# Altium project Framework 2 USB-C Expansion Card.PrjPcb
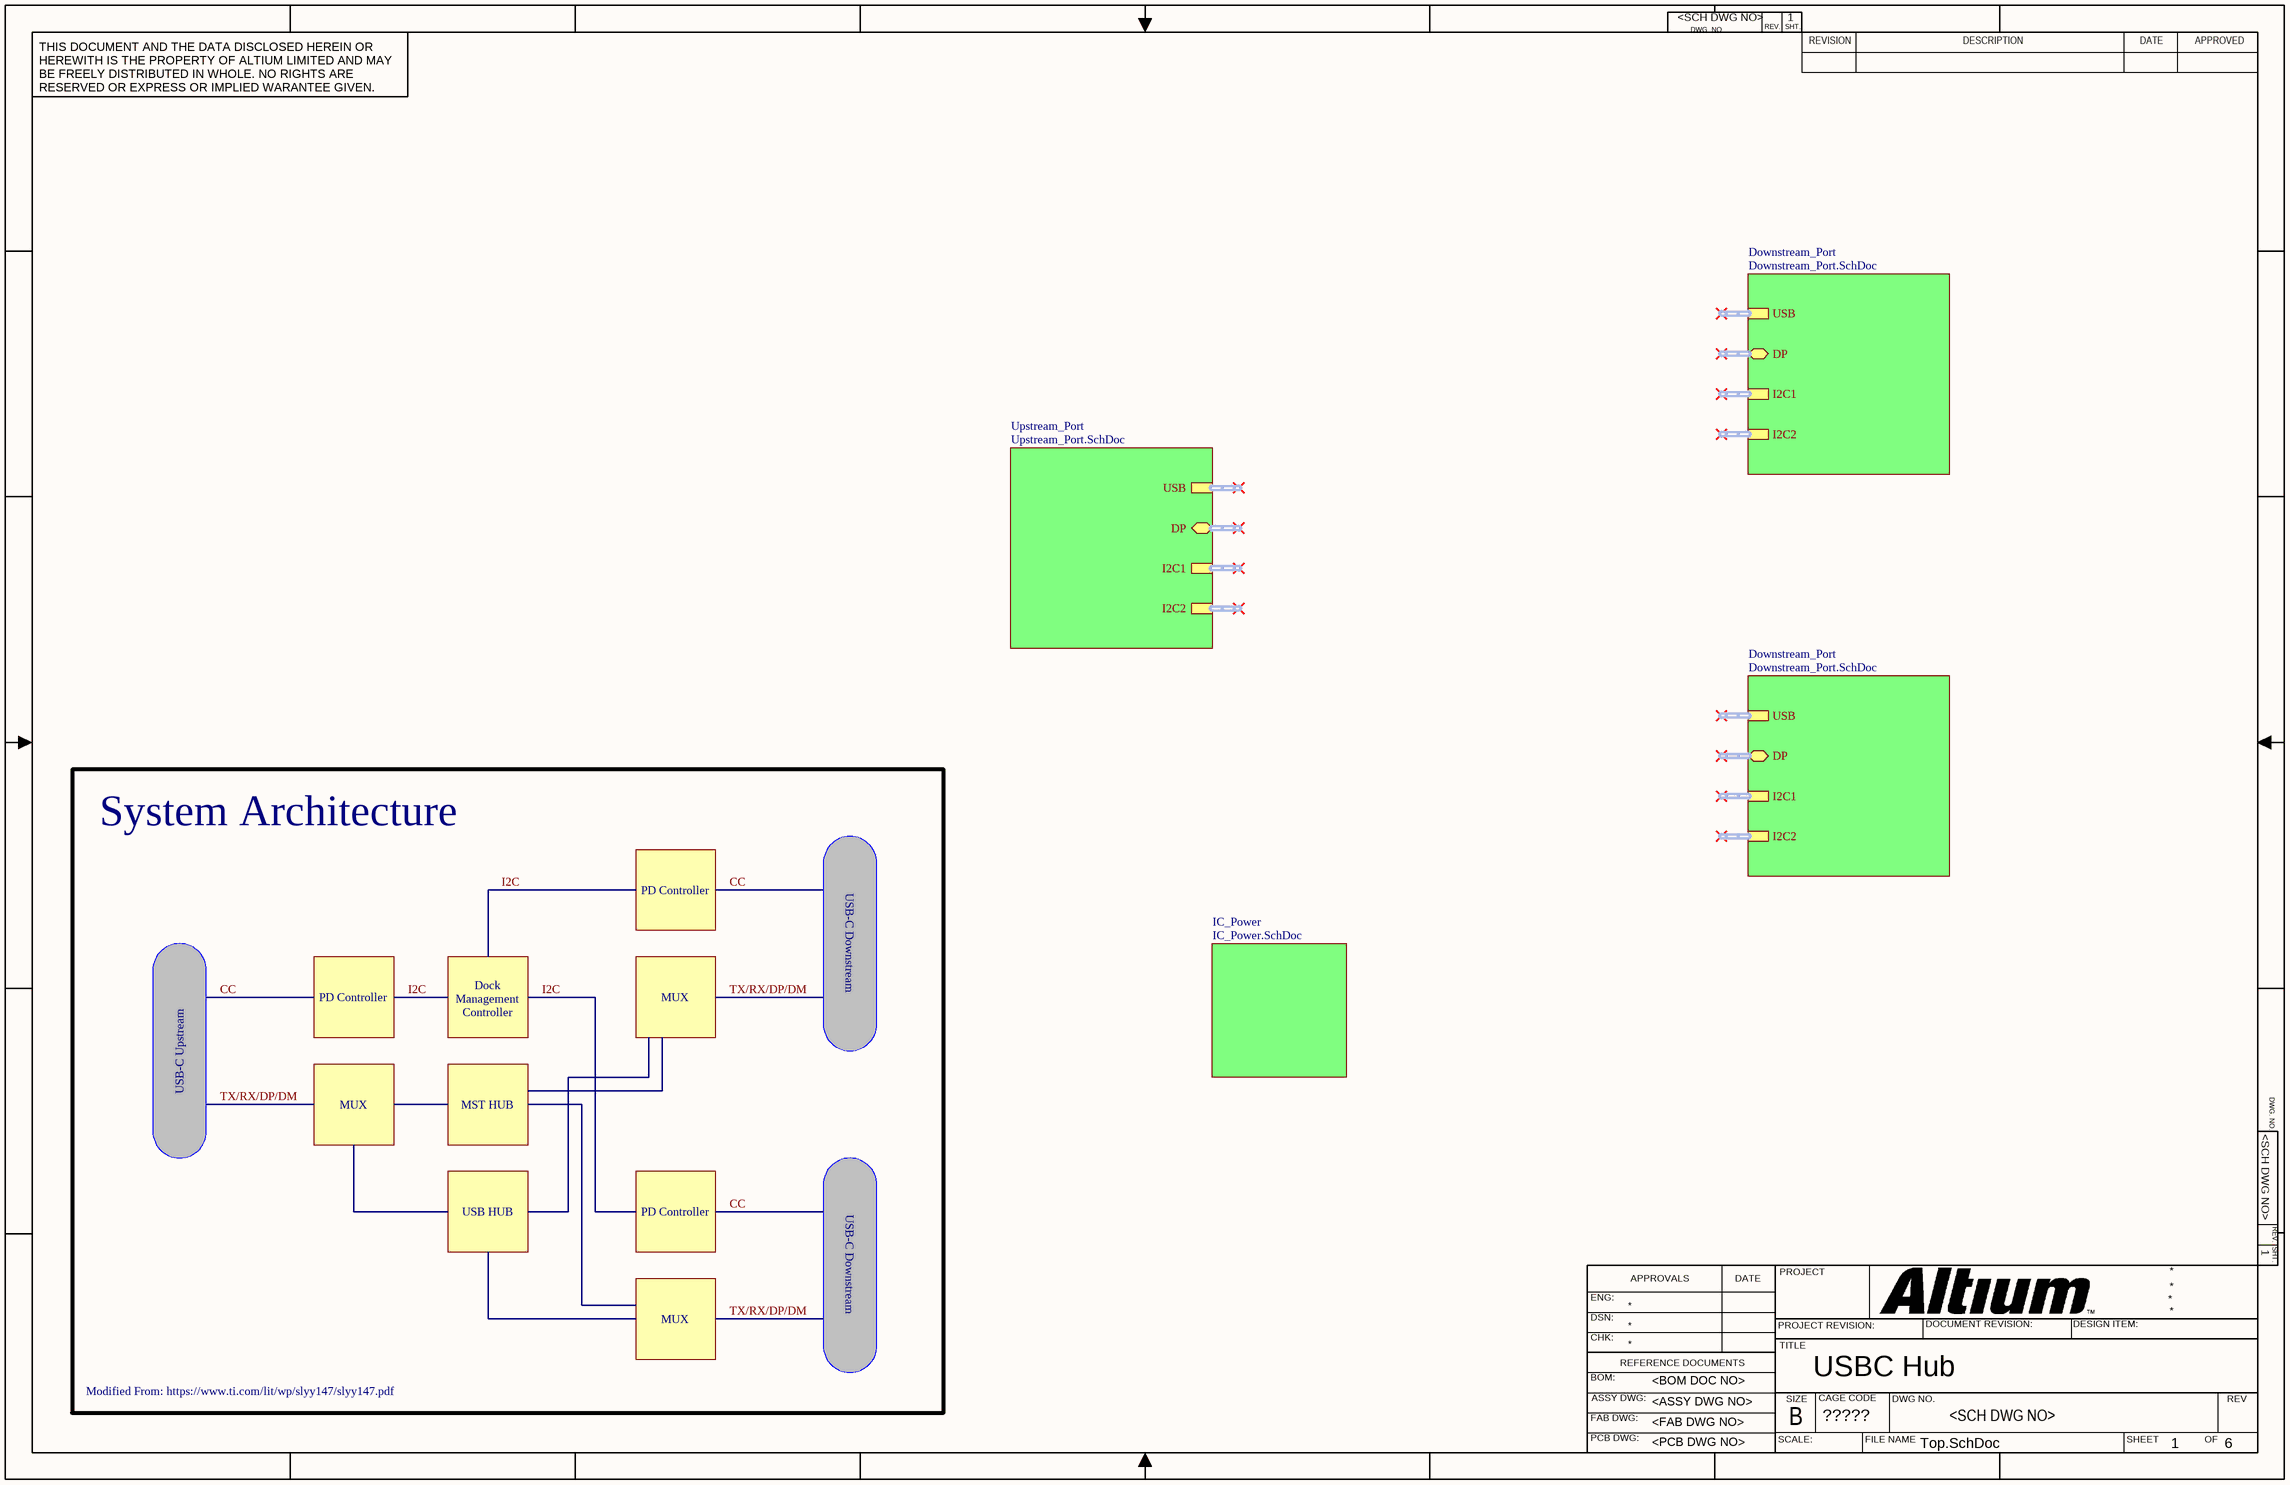
[diagram p0: Top.SchDoc]
CAGE_CODE: ?????; CONTRACT_NUMBER: <CONTRACT NO>; DOC_NO_ASSY_DWG: <ASSY DWG NO>; DOC_NO_BOM: <BOM DOC NO>; DOC_NO_FAB_DWG: <FAB DWG NO>; DOC_NO_SCH_DWG: <SCH DWG NO>; PCB_2_DEC_TOL: +/-.01; PCB_3_DEC_TOL: +/-.010; PCB_ANG_TOL: +/-1/2; PCB_ASSEMBLY_NO: <PCB ASSY NO>; PCB_CHECKER: - -----; PCB_CHECKER_APP_DATE: --/--/----; PCB_DESIGNER: - -----; PCB_DESIGNER_APP_DATE: --/--/----; PCB_DWG_NO: <PCB DWG NO>; PCB_ENGINEER: - -----; PCB_ENGINEER_APP_DATE: --/--/----; PCB_PART_NUMBER: <PCB PN>; PCB_REV: A; SCH_REV: A
6 sheets, 168 parts. Net scope: hierarchical (ports join the sheet entries above them; power ports are global).
Board file: PCB1.PcbDoc
Sheets:
  Top.SchDoc
    Downstream_Port = Downstream_Port.SchDoc
      Port_Controller = Port_Controller.SchDoc
      Port_Power = Port_Power.SchDoc
    Upstream_Port = Upstream_Port.SchDoc
      Port_Controller = Port_Controller.SchDoc
      Port_Power = Port_Power.SchDoc
    IC_Power = IC_Power.SchDoc
    Downstream_Port = Downstream_Port.SchDoc
      Port_Controller = Port_Controller.SchDoc
      Port_Power = Port_Power.SchDoc

## Sheet Top.SchDoc: USBC Hub
size 431 x 279 mm; Author: Eric Liu; SheetNumber: 1; SheetTotal: 6

### Sub-sheets
Downstream_Port = Downstream_Port.SchDoc: USB (harness USB), I2C1 (harness USB), DP (bidir, harness DP), I2C2 (harness USB)
Downstream_Port = Downstream_Port.SchDoc: USB (harness USB), I2C1 (harness USB), DP (bidir, harness DP), I2C2 (harness USB)
IC_Power = IC_Power.SchDoc: no entries
Upstream_Port = Upstream_Port.SchDoc: USB (harness USB), I2C1 (harness USB), DP (bidir, harness DP), I2C2 (harness USB)

### Notes on the sheet
- System Architecture
- PD Controller
- USB-C Downstream
- Dock
  Management
  Controller
- MUX
- USB-C Upstream
- MST HUB
- USB HUB
- Modified From: https://www.ti.com/lit/wp/slyy147/slyy147.pdf
- DWG. NO.
- REV.
- SHT.
- THIS DOCUMENT AND THE DATA DISCLOSED HEREIN OR HEREWITH IS THE PROPERTY OF ALTIUM LIMITED AND MAY BE FREELY DISTRIBUTED IN WHOLE. NO RIGHTS ARE RESERVED OR EXPRESS OR IMPLIED WARANTEE GIVEN.
- REVISION
- DESCRIPTION
- DATE
- APPROVED
- ENG:
- APPROVALS
- PROJECT
- DSN:
- CHK:
- REFERENCE DOCUMENTS
- PROJECT REVISION:
- TITLE
- DOCUMENT REVISION:
- DESIGN ITEM:
- BOM:
- FAB DWG:
- PCB DWG:
- ASSY DWG:
- SCALE:
- SIZE
- B
- CAGE CODE
- FILE NAME
- DWG NO.
- SHEET
- OF
- REV

## Sheet Downstream_Port.SchDoc: Downstream Port
size 431 x 279 mm; Author: Eric Liu; SheetNumber: 2; SheetTotal: 6
Used 2 times, as channels Downstream_Port, Downstream_Port. Parts and nets are listed once, with the designators drawn on the sheet.
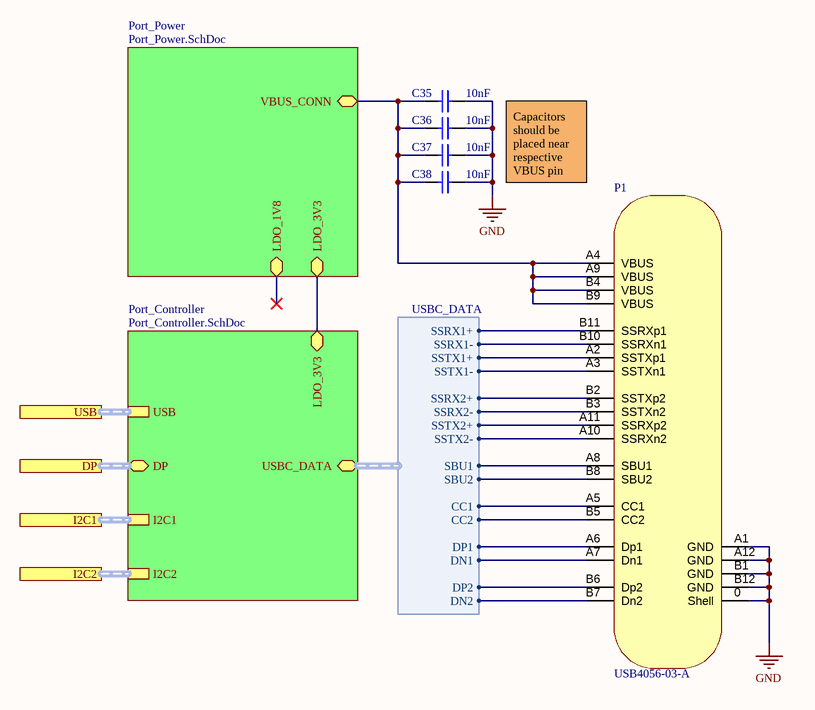
[diagram p1: Downstream_Port.SchDoc]

### Parts
C35  value 10nF  [CAP0402]  (hidden comment: CC0402KRX7R9BB103)
C36  value 10nF  [CAP0402]  (hidden comment: CC0402KRX7R9BB103)
C37  value 10nF  [CAP0402]  (hidden comment: CC0402KRX7R9BB103)
C38  value 10nF  [CAP0402]  (hidden comment: CC0402KRX7R9BB103)
P1  USB4056-03-A  [USB4056-03-A]

### Sub-sheets
Port_Controller = Port_Controller.SchDoc: USB (harness USB), I2C1 (harness USB), DP (bidir, harness DP), USBC_DATA (bidir, harness USBC_DATA), LDO_3V3 (bidir), I2C2 (harness USB)
Port_Power = Port_Power.SchDoc: LDO_3V3 (bidir), LDO_1V8 (bidir), VBUS_CONN (bidir)

### Ports
DP, I2C1, I2C2, USB

### Harnesses
USBC_DATA: SSRX1+, SSRX1-, SSTX1+, SSTX1-, SSRX2+, SSRX2-, SSTX2+, SSTX2-, CC1, CC2, SBU1, SBU2, DP1, DN1, DP2, DN2

### Nets
GND: C35.1 C36.1 C37.1 C38.1 P1.0(Shell) P1.A1(GND) P1.A12(GND) P1.B1(GND) P1.B12(GND)
NetC35_2: C35.2 C36.2 C37.2 C38.2 P1.A4(VBUS) P1.A9(VBUS) P1.B4(VBUS) P1.B9(VBUS) ; sheet Port_Power/VBUS_CONN
NetP1_A2: P1.A2(SSTXp1) ; sheet Port_Controller/USBC_DATA.SSTX1+
NetP1_A3: P1.A3(SSTXn1) ; sheet Port_Controller/USBC_DATA.SSTX1-
NetP1_A5: P1.A5(CC1) ; sheet Port_Controller/USBC_DATA.CC1
NetP1_A6: P1.A6(Dp1) ; sheet Port_Controller/USBC_DATA.DP1
NetP1_A7: P1.A7(Dn1) ; sheet Port_Controller/USBC_DATA.DN1
NetP1_A8: P1.A8(SBU1) ; sheet Port_Controller/USBC_DATA.SBU1
NetP1_A10: P1.A10(SSRXn2) ; sheet Port_Controller/USBC_DATA.SSTX2-
NetP1_A11: P1.A11(SSRXp2) ; sheet Port_Controller/USBC_DATA.SSTX2+
NetP1_B2: P1.B2(SSTXp2) ; sheet Port_Controller/USBC_DATA.SSRX2+
NetP1_B3: P1.B3(SSTXn2) ; sheet Port_Controller/USBC_DATA.SSRX2-
NetP1_B5: P1.B5(CC2) ; sheet Port_Controller/USBC_DATA.CC2
NetP1_B6: P1.B6(Dp2) ; sheet Port_Controller/USBC_DATA.DP2
NetP1_B7: P1.B7(Dn2) ; sheet Port_Controller/USBC_DATA.DN2
NetP1_B8: P1.B8(SBU2) ; sheet Port_Controller/USBC_DATA.SBU2
NetP1_B10: P1.B10(SSRXn1) ; sheet Port_Controller/USBC_DATA.SSRX1-
NetP1_B11: P1.B11(SSRXp1) ; sheet Port_Controller/USBC_DATA.SSRX1+
(unnamed): sheet Port_Controller/LDO_3V3, sheet Port_Power/LDO_3V3

### Channels
Downstream_Port: designators end in _1
Downstream_Port: designators end in _2

### Buses and harness runs
harness port DP = sheet Port_Controller/DP
harness port I2C1 = sheet Port_Controller/I2C1
harness port I2C2 = sheet Port_Controller/I2C2
harness port USB = sheet Port_Controller/USB

### Notes on the sheet
- Capacitors should be placed near respective VBUS pin
- DWG. NO.
- REV.
- SHT.
- THIS DOCUMENT AND THE DATA DISCLOSED HEREIN OR HEREWITH IS THE PROPERTY OF ALTIUM LIMITED AND MAY BE FREELY DISTRIBUTED IN WHOLE. NO RIGHTS ARE RESERVED OR EXPRESS OR IMPLIED WARANTEE GIVEN.
- REVISION
- DESCRIPTION
- DATE
- APPROVED
- ENG:
- APPROVALS
- PROJECT
- DSN:
- CHK:
- REFERENCE DOCUMENTS
- PROJECT REVISION:
- TITLE
- DOCUMENT REVISION:
- DESIGN ITEM:
- BOM:
- FAB DWG:
- PCB DWG:
- ASSY DWG:
- SCALE:
- SIZE
- B
- CAGE CODE
- FILE NAME
- DWG NO.
- SHEET
- OF
- REV

### Library data of the parts
C35-C38 = CC0402KRX7R9BB103: 10000 pF ±10% 50V Ceramic Capacitor X7R 0402 (1005 Metric); Temperature Coefficient: X7R; Package: 0402 (1005 Metric); Voltage: 50V
P1 = USB4056-03-A: USB-C (USB TYPE-C) USB 3.2 Gen 2 (USB 3.1 Gen 2, Superspeed + (USB 3.1)) Receptacle Connector 24 Position Surface Mount, Right Angle; Through Hole; Manufacturer: GCT; Voltage: 48VDC; Manufacturer Product Number: USB4056-03-A; Supplier: DigiKey; Supplier Part Number: 2073-USB4056-03-ACT-ND; Datasheet: https://gct.co/connector/usb4056; Standards: USB 3.2 Gen 2; Operating Temperature: -25°C ~ 85°C

## Sheet Port_Controller.SchDoc: USBC Port Controller
size 431 x 279 mm; Author: Eric Liu; Revision: 1; SheetNumber: 3; SheetTotal: 6
Used 3 times, as channels Downstream_Port/Port_Controller, Upstream_Port/Port_Controller, Downstream_Port/Port_Controller. Parts and nets are listed once, with the designators drawn on the sheet.
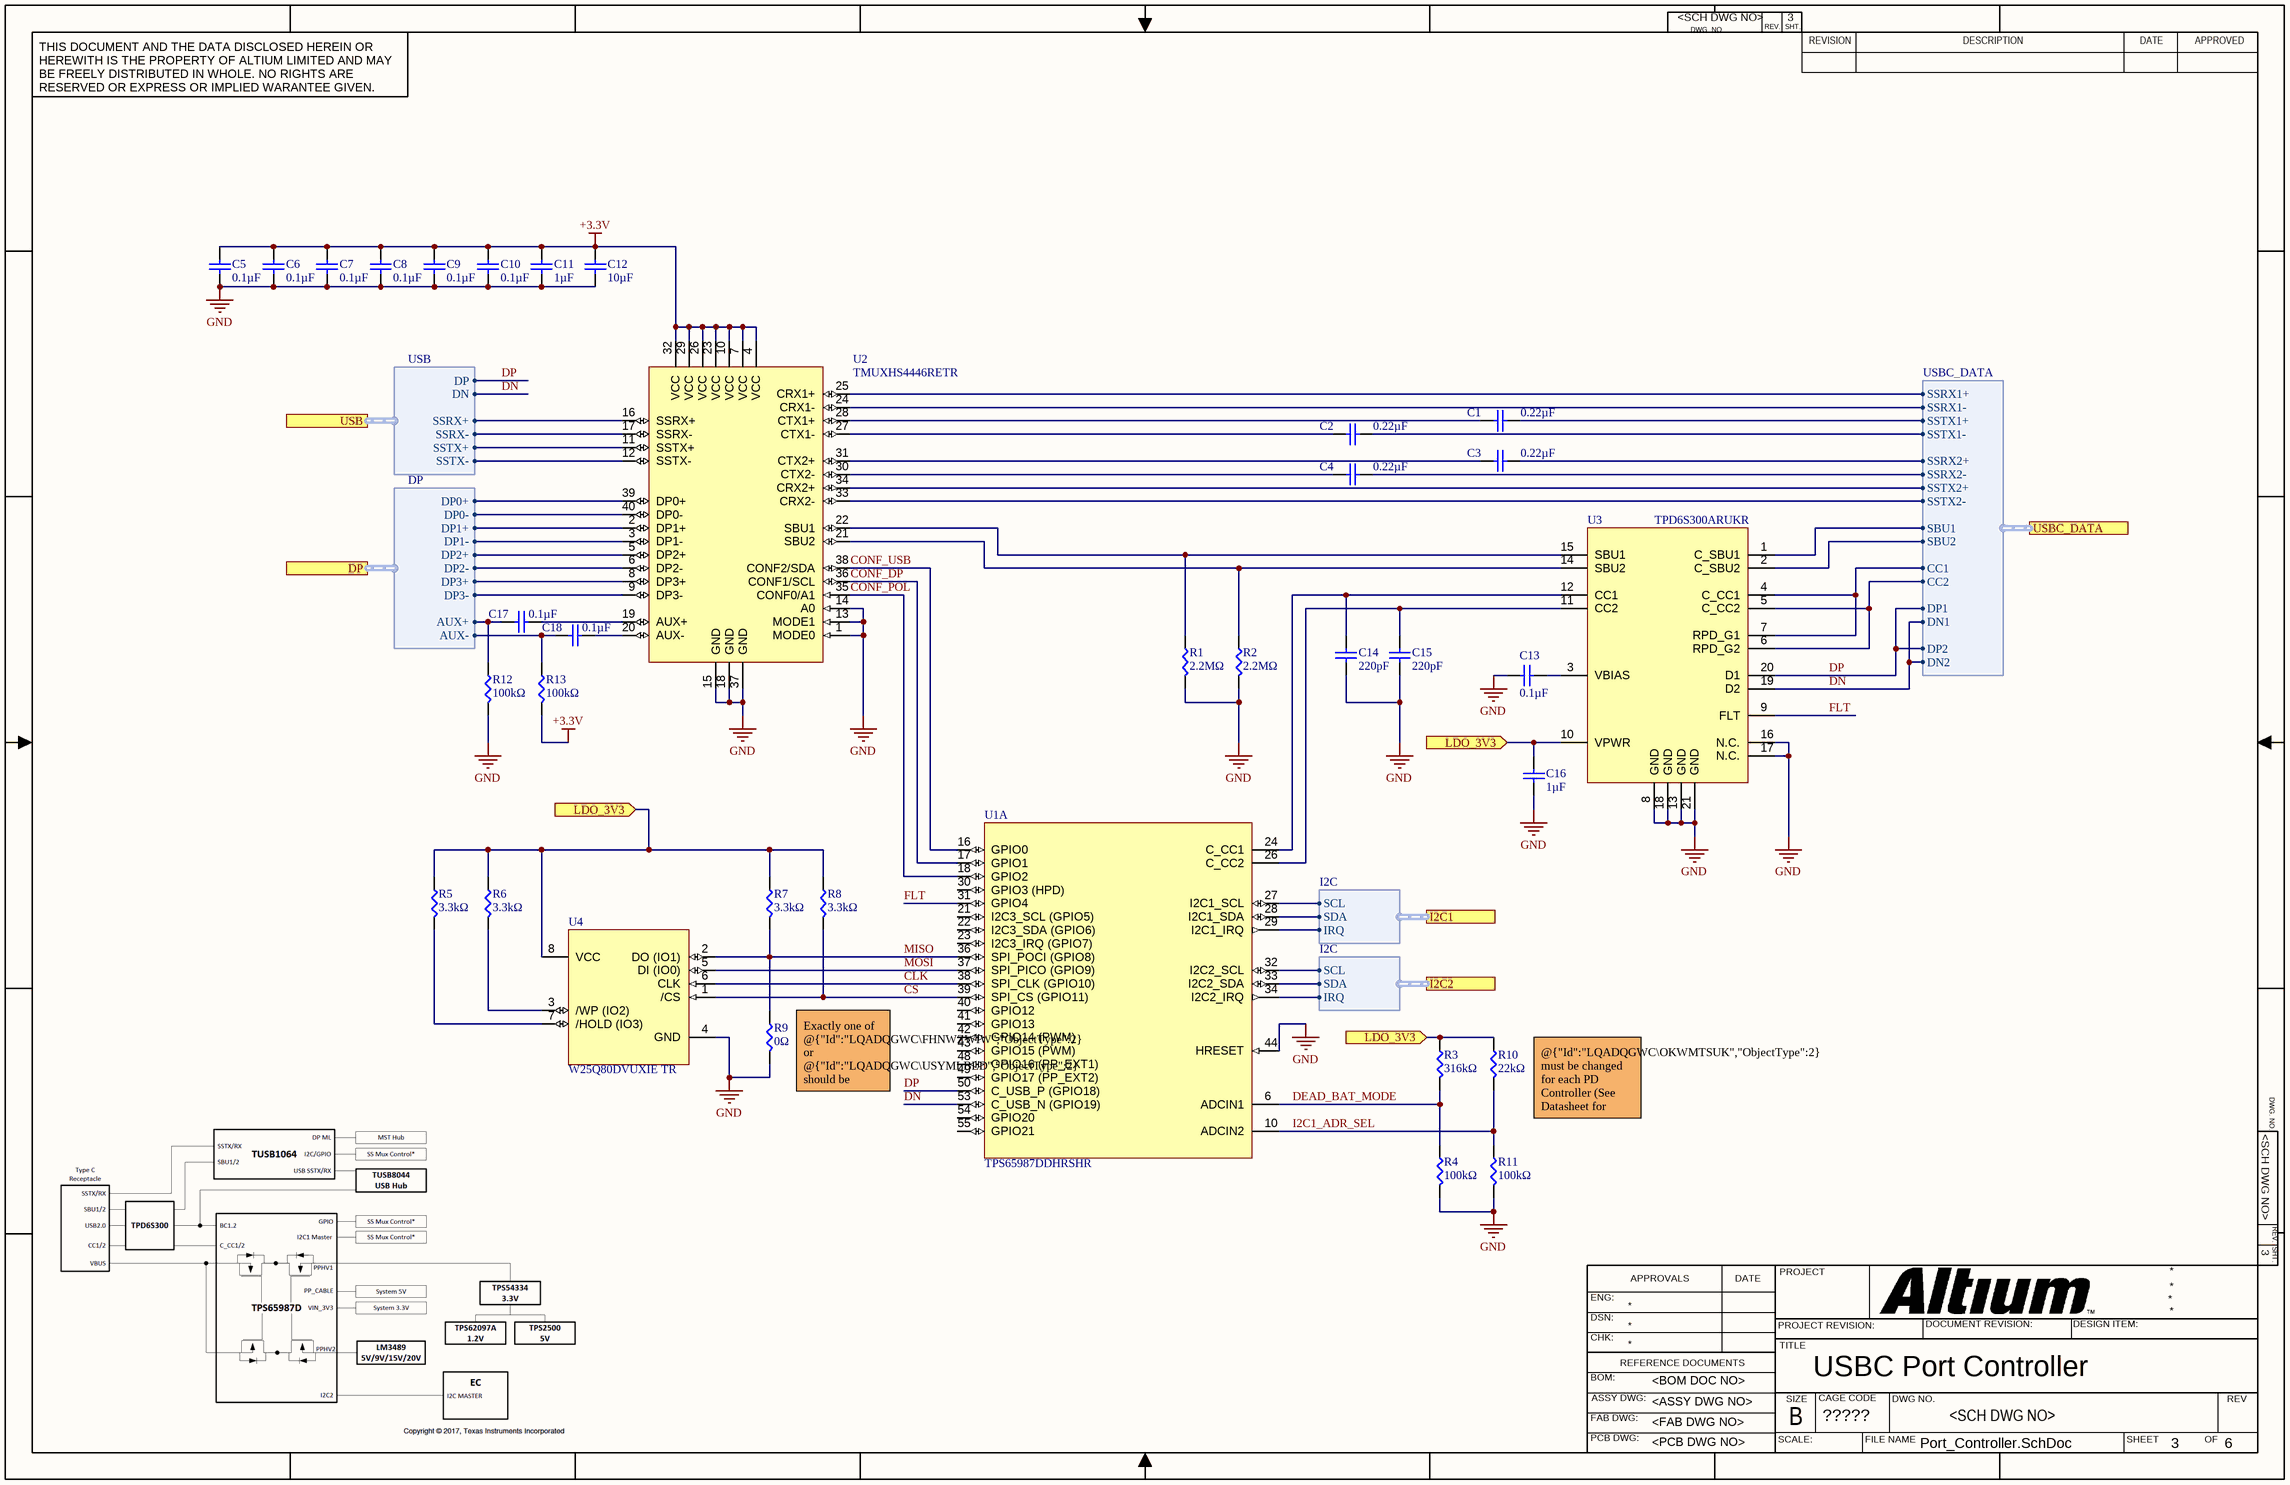
[diagram p2: Port_Controller.SchDoc]

### Parts
C1  value 0.22µF  [CAP0402]  (hidden comment: UMK105BJ224KV-F)
C2  value 0.22µF  [CAP0402]  (hidden comment: UMK105BJ224KV-F)
C3  value 0.22µF  [CAP0402]  (hidden comment: UMK105BJ224KV-F)
C4  value 0.22µF  [CAP0402]  (hidden comment: UMK105BJ224KV-F)
C5  value 0.1µF  [CAP0402]  (hidden comment: CC0402KRX5R9BB104)
C6  value 0.1µF  [CAP0402]  (hidden comment: CC0402KRX5R9BB104)
C7  value 0.1µF  [CAP0402]  (hidden comment: CC0402KRX5R9BB104)
C8  value 0.1µF  [CAP0402]  (hidden comment: CC0402KRX5R9BB104)
C9  value 0.1µF  [CAP0402]  (hidden comment: CC0402KRX5R9BB104)
C10  value 0.1µF  [CAP0402]  (hidden comment: CC0402KRX5R9BB104)
C11  value 1µF  [CAP0402]  (hidden comment: GRM155R61H105KE05D)
C12  value 10µF  [CAP0402]  (hidden comment: CL05A106MQ5NUNC)
C13  value 0.1µF  [CAP0402]  (hidden comment: CC0402KRX5R9BB104)
C14  value 220pF  [CAP0402]  (hidden comment: GRM1555C1H221JA01D)
C15  value 220pF  [CAP0402]  (hidden comment: GRM1555C1H221JA01D)
C16  value 1µF  [CAP0402]  (hidden comment: GRM155R61H105KE05D)
C17  value 0.1µF  [CAP0402]  (hidden comment: CC0402KRX5R9BB104)
C18  value 0.1µF  [CAP0402]  (hidden comment: CC0402KRX5R9BB104)
R1  value 2.2MΩ  [RES0402]  (hidden comment: RC0402FR-072M2L)
R2  value 2.2MΩ  [RES0402]  (hidden comment: RC0402FR-072M2L)
R3  value 316kΩ  [RES0402]  (hidden comment: CRCW0402316KFKED)
R4  value 100kΩ  [RES0402]  (hidden comment: ERJ-2RKF1003X)
R5  value 3.3kΩ  [RES0402]  (hidden comment: ERA-2AEB332X)
R6  value 3.3kΩ  [RES0402]  (hidden comment: ERA-2AEB332X)
R7  value 3.3kΩ  [RES0402]  (hidden comment: ERA-2AEB332X)
R8  value 3.3kΩ  [RES0402]  (hidden comment: ERA-2AEB332X)
R9  value 0Ω  [RES0402]  (hidden comment: RC0402JR-070RL)
R10  value 22kΩ  [RES0402]  (hidden comment: ERJ-2RKF2202X)
R11  value 100kΩ  [RES0402]  (hidden comment: ERJ-2RKF1003X)
R12  value 100kΩ  [RES0402]  (hidden comment: ERJ-2RKF1003X)
R13  value 100kΩ  [RES0402]  (hidden comment: ERJ-2RKF1003X)
U1  TPS65987DDHRSHR  [56-VQFN (7x7)]  (part A of 2)
U2  TMUXHS4446RETR
U3  TPD6S300ARUKR
U4  W25Q80DVUXIE TR

### Ports
DP (harness DP), I2C1 (harness I2C), I2C2 (harness I2C), LDO_3V3 (in), USB (harness USB), USBC_DATA (harness USBC_DATA)

### Harnesses
DP: AUX+, AUX-, DP0+, DP0-, DP1+, DP1-, DP2+, DP2-, DP3+, DP3-
USB: DP, DN, SSRX+, SSRX-, SSTX+, SSTX-
USBC_DATA: SSRX1+, SSRX1-, SSTX1+, SSTX1-, SSRX2+, SSRX2-, SSTX2+, SSTX2-, CC1, CC2, SBU1, SBU2, DP1, DN1, DP2, DN2
I2C: SCL, SDA, IRQ

### Nets
+3.3V: C5.2 C6.2 C7.2 C8.2 C9.2 C10.2 C11.2 C12.2 R13.1 U2.4(VCC) U2.7(VCC) U2.10(VCC) U2.23(VCC) U2.26(VCC) U2.29(VCC) U2.32(VCC)
GND: C5.1 C6.1 C7.1 C8.1 C9.1 C10.1 C11.1 C12.1 C13.1 C14.1 C15.1 C16.1 R1.1 R2.1 R4.1 R9.1 R11.1 R12.1 U1.44(HRESET) U2.1(MODE0) U2.13(MODE1) U2.14(A0) U2.15(GND) U2.18(GND) U2.37(GND) U3.8(GND) U3.13(GND) U3.16(N.C.) U3.17(N.C.) U3.18(GND) U3.21(GND) U4.4(GND)
CLK: U1.38(SPI_CLK_(GPIO10)) U4.6(CLK)
CONF_DP: U1.17(GPIO1) U2.36(CONF1/SCL)
CONF_POL: U1.18(GPIO2) U2.35(CONF0/A1)
CONF_USB: U1.16(GPIO0) U2.38(CONF2/SDA)
CS: R8.1 U1.39(SPI_CS_(GPIO11)) U4.1(/CS)
DEAD_BAT_MODE: R3.1 R4.2 U1.6(ADCIN1)
DN: U1.53(C_USB_N_(GPIO19)) U3.19(D2) ; port USB.DN, port USBC_DATA.DN1, port USBC_DATA.DN2
DP: U1.50(C_USB_P_(GPIO18)) U3.20(D1) ; port USB.DP, port USBC_DATA.DP1, port USBC_DATA.DP2
FLT: U1.31(GPIO4) U3.9(FLT)
I2C1_ADR_SEL: R10.1 R11.2 U1.10(ADCIN2)
LDO_3V3: C16.2 R3.2 R5.2 R6.2 R7.2 R8.2 R10.2 U3.10(VPWR) U4.8(VCC) ; port LDO_3V3
MISO: R7.1 R9.2 U1.36(SPI_POCI_(GPIO8)) U4.2(DO_(IO1))
MOSI: U1.37(SPI_PICO_(GPIO9)) U4.5(DI_(IO0))
NetC1_1: C1.1 U2.28(CTX1+)
NetC1_2: C1.2 ; port USBC_DATA.SSTX1+
NetC2_1: C2.1 U2.27(CTX1-)
NetC2_2: C2.2 ; port USBC_DATA.SSTX1-
NetC3_1: C3.1 U2.31(CTX2+)
NetC3_2: C3.2 ; port USBC_DATA.SSRX2+
NetC4_1: C4.1 U2.30(CTX2-)
NetC4_2: C4.2 ; port USBC_DATA.SSRX2-
NetC13_2: C13.2 U3.3(VBIAS)
NetC14_2: C14.2 U1.24(C_CC1) U3.12(CC1)
NetC15_2: C15.2 U1.26(C_CC2) U3.11(CC2)
NetC17_1: C17.1 R12.2 ; port DP.AUX+
NetC17_2: C17.2 U2.19(AUX+)
NetC18_1: C18.1 R13.2 ; port DP.AUX-
NetC18_2: C18.2 U2.20(AUX-)
NetR1_2: R1.2 U2.22(SBU1) U3.15(SBU1)
NetR2_2: R2.2 U2.21(SBU2) U3.14(SBU2)
NetR5_1: R5.1 U4.7(/HOLD_(IO3))
NetR6_1: R6.1 U4.3(/WP_(IO2))
NetU1_27: U1.27(I2C1_SCL) ; port I2C1.SCL
NetU1_28: U1.28(I2C1_SDA) ; port I2C1.SDA
NetU1_29: U1.29(I2C1_IRQ) ; port I2C1.IRQ
NetU1_32: U1.32(I2C2_SCL) ; port I2C2.SCL
NetU1_33: U1.33(I2C2_SDA) ; port I2C2.SDA
NetU1_34: U1.34(I2C2_IRQ) ; port I2C2.IRQ
NetU2_2: U2.2(DP1+) ; port DP.DP1+
NetU2_3: U2.3(DP1-) ; port DP.DP1-
NetU2_5: U2.5(DP2+) ; port DP.DP2+
NetU2_6: U2.6(DP2-) ; port DP.DP2-
NetU2_8: U2.8(DP3+) ; port DP.DP3+
NetU2_9: U2.9(DP3-) ; port DP.DP3-
NetU2_11: U2.11(SSTX+) ; port USB.SSTX+
NetU2_12: U2.12(SSTX-) ; port USB.SSTX-
NetU2_16: U2.16(SSRX+) ; port USB.SSRX+
NetU2_17: U2.17(SSRX-) ; port USB.SSRX-
NetU2_24: U2.24(CRX1-) ; port USBC_DATA.SSRX1-
NetU2_25: U2.25(CRX1+) ; port USBC_DATA.SSRX1+
NetU2_33: U2.33(CRX2-) ; port USBC_DATA.SSTX2-
NetU2_34: U2.34(CRX2+) ; port USBC_DATA.SSTX2+
NetU2_39: U2.39(DP0+) ; port DP.DP0+
NetU2_40: U2.40(DP0-) ; port DP.DP0-
NetU3_1: U3.1(C_SBU1) ; port USBC_DATA.SBU1
NetU3_2: U3.2(C_SBU2) ; port USBC_DATA.SBU2
NetU3_4: U3.4(C_CC1) U3.7(RPD_G1) ; port USBC_DATA.CC1
NetU3_5: U3.5(C_CC2) U3.6(RPD_G2) ; port USBC_DATA.CC2

Not connected (* = marked no-connect by the designer): U1 21(I2C3_SCL_(GPIO5)) 22(I2C3_SDA_(GPIO6)) 23(I2C3_IRQ_(GPIO7)) 30(GPIO3_(HPD)) 40(GPIO12) 41(GPIO13) 42(GPIO14_(PWM)) 43(GPIO15_(PWM)) 48(GPIO16_(PP_EXT1)) 49(GPIO17_(PP_EXT2)) 54(GPIO20) 55(GPIO21)

### Channels
Downstream_Port/Port_Controller: designators C1=C1_1 C2=C2_1 C3=C3_1 C4=C4_1 C5=C5_1 C6=C6_1 C7=C7_1 C8=C8_1 C9=C9_1 C10=C10_1 C11=C11_1 C12=C12_1 C13=C13_1 C14=C14_1 C15=C15_1 C16=C16_1 C17=C17_1 C18=C18_1 R1=R1_1 R2=R2_1 R3=R3_1 R4=R4_1 R5=R5_1 R6=R6_1 R7=R7_1 R8=R8_1 R9=R9_1 R10=R10_1 R11=R11_1 R12=R12_1 R13=R13_1 U1=U1_1#1 U2=U2_1 U3=U3_1 U4=U4_1; ports LDO_3V3=NetC16_1_2
Upstream_Port/Port_Controller: designators C1=C1_2 C2=C2_2 C3=C3_2 C4=C4_2 C5=C5_2 C6=C6_2 C7=C7_2 C8=C8_2 C9=C9_2 C10=C10_2 C11=C11_2 C12=C12_2 C13=C13_2 C14=C14_2 C15=C15_2 C16=C16_2 C17=C17_2 C18=C18_2 R1=R1_2 R2=R2_2 R3=R3_2 R4=R4_2 R5=R5_2 R6=R6_2 R7=R7_2 R8=R8_2 R9=R9_2 R10=R10_2 R11=R11_2 R12=R12_2 R13=R13_2 U1=U1_2#1 U2=U2_2 U3=U3_2 U4=U4_2; ports LDO_3V3=NetC16_2_2
Downstream_Port/Port_Controller: designators C1=C1_3 C2=C2_3 C3=C3_3 C4=C4_3 C5=C5_3 C6=C6_3 C7=C7_3 C8=C8_3 C9=C9_3 C10=C10_3 C11=C11_3 C12=C12_3 C13=C13_3 C14=C14_3 C15=C15_3 C16=C16_3 C17=C17_3 C18=C18_3 R1=R1_3 R2=R2_3 R3=R3_3 R4=R4_3 R5=R5_3 R6=R6_3 R7=R7_3 R8=R8_3 R9=R9_3 R10=R10_3 R11=R11_3 R12=R12_3 R13=R13_3 U1=U1_3#1 U2=U2_3 U3=U3_3 U4=U4_3; ports LDO_3V3=NetC16_3_2

### Notes on the sheet
- (near R9) Exactly one of @{"Id":"LQADQGWC\FHNWZWIW","ObjectType":2} or @{"Id":"LQADQGWC\USYMLBLD","ObjectType":2} should be attached (see Variants)
- @{"Id":"LQADQGWC\OKWMTSUK","ObjectType":2} must be changed for each PD Controller (See Datasheet for addresses)
- DWG. NO.
- REV.
- SHT.
- THIS DOCUMENT AND THE DATA DISCLOSED HEREIN OR HEREWITH IS THE PROPERTY OF ALTIUM LIMITED AND MAY BE FREELY DISTRIBUTED IN WHOLE. NO RIGHTS ARE RESERVED OR EXPRESS OR IMPLIED WARANTEE GIVEN.
- REVISION
- DESCRIPTION
- DATE
- APPROVED
- ENG:
- APPROVALS
- PROJECT
- DSN:
- CHK:
- REFERENCE DOCUMENTS
- PROJECT REVISION:
- TITLE
- DOCUMENT REVISION:
- DESIGN ITEM:
- BOM:
- FAB DWG:
- PCB DWG:
- ASSY DWG:
- SCALE:
- SIZE
- B
- CAGE CODE
- FILE NAME
- DWG NO.
- SHEET
- OF
- REV

### Library data of the parts
C1-C4 = UMK105BJ224KV-F: 0.22 µF ±10% 50V Ceramic Capacitor X5R 0402 (1005 Metric); Temperature Coefficient: X5R; Package: 0402 (1005 Metric); Voltage: 50V
C5-C10 C13 C17 C18 = CC0402KRX5R9BB104: 0.1 µF ±10% 50V Ceramic Capacitor X5R 0402 (1005 Metric); Temperature Coefficient: X5R; Package: 0402 (1005 Metric); Voltage: 50V
C11 C16 = GRM155R61H105KE05D: 1 µF ±10% 50V Ceramic Capacitor X5R 0402 (1005 Metric); Temperature Coefficient: X5R; Package: 0402 (1005 Metric); Voltage: 50V
C12 = CL05A106MQ5NUNC: 10 µF ±20% 6.3V Ceramic Capacitor X5R 0402 (1005 Metric); Temperature Coefficient: C0G, NP0; Package: 0402 (1005 Metric); Voltage: 6.3V
C14 C15 = GRM1555C1H221JA01D: 220 pF ±5% 50V Ceramic Capacitor C0G, NP0 0402 (1005 Metric); Temperature Coefficient: C0G, NP0; Package: 0402 (1005 Metric); Voltage: 50V
R1 R2 = RC0402FR-072M2L: 2.2 MOhms ±1% 0.063W, 1/16W Chip Resistor 0402 (1005 Metric) Moisture Resistant Thick Film; Manufacturer 1: YAGEO; Manufacturer Part Number 1: RC0402FR-072M2L; Supplier Part Number 1: 13-RC0402FR-072M2LCT-ND; Supplier 1: Digi-Key; Power Rating: 1/16W
R3 = CRCW0402316KFKED: 316 kOhms ±1% 0.1W, 1/10W Chip Resistor 0402 (1005 Metric) Automotive AEC-Q200 Thick Film; Manufacturer 1: Vishay Dale; Manufacturer Part Number 1: CRCW0402316KFKED; Supplier Part Number 1: 541-316KLCT-ND; Supplier 1: Digi-Key; Power Rating: 1/10W
R4 R11-R13 = ERJ-2RKF1003X: 100 kOhms ±1% 0.1W, 1/10W Chip Resistor 0402 (1005 Metric) Automotive AEC-Q200 Thick Film; Manufacturer 1: Panasonic Electronic Components; Manufacturer Part Number 1: ERJ-2RKF1003X; Supplier Part Number 1: P100KLCT-ND; Supplier 1: Digi-Key; Power Rating: 1/10W
R5-R8 = ERA-2AEB332X: 3.3 kOhms ±0.1% 0.063W, 1/16W Chip Resistor 0402 (1005 Metric) Automotive AEC-Q200 Thin Film; Manufacturer 1: Panasonic Electronic Components; Manufacturer Part Number 1: ERA-2AEB332X; Supplier Part Number 1: P3.3KDCCT-ND; Supplier 1: Digi-Key; Power Rating: 1/16W
R9 = RC0402JR-070RL: 0 Ohms Jumper Chip Resistor 0402 (1005 Metric) Moisture Resistant Thick Film; Manufacturer 1: YAGEO; Power Rating: 1/16W; Manufacturer Part Number 1: RC0402JR-070RL; Supplier Part Number 1: 311-0.0JRCT-ND; Supplier 1: Digi-Key
R10 = ERJ-2RKF2202X: 22 kOhms ±1% 0.1W, 1/10W Chip Resistor 0402 (1005 Metric) Automotive AEC-Q200 Thick Film; Manufacturer 1: Panasonic Electronic Components; Manufacturer Part Number 1: ERJ-2RKF2202X; Supplier Part Number 1: P22.0KLCT-ND; Supplier 1: Digi-Key; Power Rating: 1/10W
U1 = TPS65987DDHRSHR: USB, Type-C Controller PMIC 56-VQFN (7x7); Manufacturer: Texas Instruments; Standards: USB4 PD 3.0; Manufacturer Product Number: TPS65987DDHRSHR; Supplier: DigiKey; Supplier Part Number: 296-52067-1-ND; Datasheet: https://www.ti.com/lit/ds/symlink/tps65987d.pdf?HQS=dis-dk-null-digikeymode-dsf-pf-null-wwe&ts=1769374030059; Operating Temperature: -10°C ~ 75°C
U2 = TMUXHS4446RETR: 4 Circuit IC Switch 4:4 7Ohm (Typ) 40-WQFN (6x3); Manufacturer: Texas Instruments; Standards: USB 3.2 Gen 2, DP 2.1; Manufacturer Product Number: TMUXHS4446RETR; Supplier: DigiKey; Supplier Part Number: 296-TMUXHS4446RETRCT-ND; Datasheet: https://www.ti.com/lit/ds/symlink/tmuxhs4446.pdf?ts=1710887339890&ref_url=https%253A%252F%252Fwww.ti.com%252Fproduct%252FTMUXHS4446%253Fjktype%253Dhomepageproduct; Operating Temperature: -40°C ~ 85°C
U3 = TPD6S300ARUKR: Overvoltage/Surge Protection IC 8V Internal Switch 20-WQFN (3x3); Manufacturer: Texas Instruments; Manufacturer Product Number: TPD6S300ARUKR; Supplier: DigiKey; Supplier Part Number: 296-51856-1-ND; Datasheet: https://www.ti.com/lit/ds/symlink/tpd6s300a.pdf?ts=1769365287609; Operating Temperature: -40°C ~ 85°C
U4 = W25Q80DVUXIE TR: FLASH - NOR Memory IC 8Mbit SPI - Quad I/O 104 MHz 8-USON (2x3); Manufacturer: Winbond Electronics; Manufacturer Product Number: W25Q80DVUXIE TR; Supplier: DigiKey; Supplier Part Number: 256-W25Q80DVUXIETRCT-ND; Datasheet: https://www.winbond.com/resource-files/w25q80dv%20dl_revh_10022015.pdf; Standards: SPI - Quad I/O; Operating Temperature: -40°C ~ 85°C

## Sheet Port_Power.SchDoc: Port Power
size 431 x 279 mm; Author: Eric Liu; SheetNumber: 4; SheetTotal: 6
Used 3 times, as channels Downstream_Port/Port_Power, Upstream_Port/Port_Power, Downstream_Port/Port_Power. Parts and nets are listed once, with the designators drawn on the sheet.
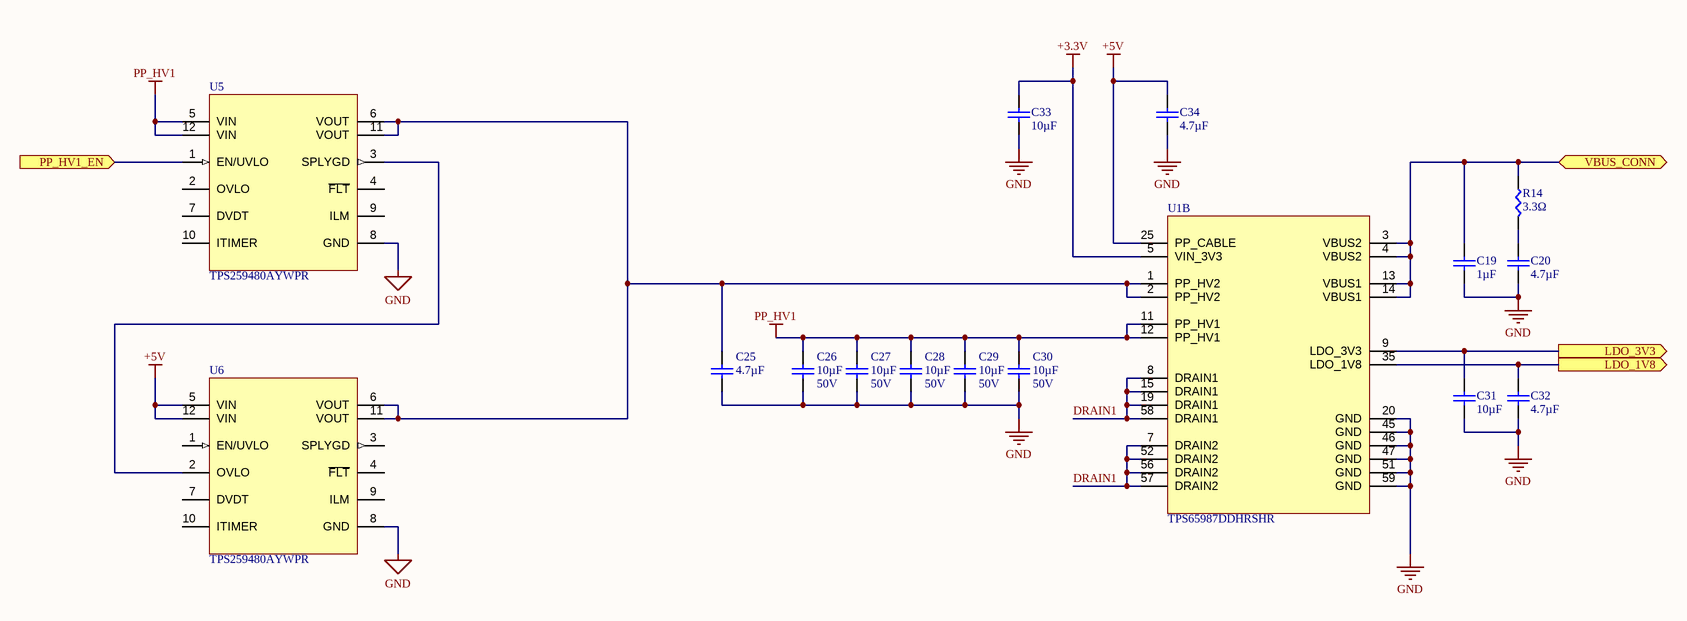
[diagram p3: Port_Power.SchDoc]

### Parts
C19  value 1µF  [CAP0402]  (hidden comment: GRM155R61H105KE05D)
C20  value 4.7µF  [CAP0805]  (hidden comment: GRT21BR61H475KE13L)
C25  value 4.7µF  [CAP0805]  (hidden comment: GRT21BR61H475KE13L)
C26  value 10µF  Voltage: 50V  [CAP1206]  (hidden comment: CL31A106KBHNNNE)
C27  value 10µF  Voltage: 50V  [CAP1206]  (hidden comment: CL31A106KBHNNNE)
C28  value 10µF  Voltage: 50V  [CAP1206]  (hidden comment: CL31A106KBHNNNE)
C29  value 10µF  Voltage: 50V  [CAP1206]  (hidden comment: CL31A106KBHNNNE)
C30  value 10µF  Voltage: 50V  [CAP1206]  (hidden comment: CL31A106KBHNNNE)
C31  value 10µF  [CAP0402]  (hidden comment: CL05A106MQ5NUNC)
C32  value 4.7µF  [CAP0805]  (hidden comment: GRT21BR61H475KE13L)
C33  value 10µF  [CAP0402]  (hidden comment: CL05A106MQ5NUNC)
C34  value 4.7µF  [CAP0805]  (hidden comment: GRT21BR61H475KE13L)
R14  value 3.3Ω  [RES0402]  (hidden comment: ESR10EZPJ3R3)
U1  TPS65987DDHRSHR  [56-VQFN (7x7)]  (part B of 2)
U5  TPS259480AYWPR
U6  TPS259480AYWPR

### Ports
LDO_1V8 (out), LDO_3V3 (out), PP_HV1_EN (in), VBUS_CONN (bidir)

### Nets
+3.3V: C33.2 U1.5(VIN_3V3)
+5V: C34.2 U1.25(PP_CABLE) U6.5(VIN) U6.12(VIN)
GND: C19.1 C20.1 C25.2 C26.1 C27.1 C28.1 C29.1 C30.1 C31.1 C32.1 C33.1 C34.1 U1.20(GND) U1.45(GND) U1.46(GND) U1.47(GND) U1.51(GND) U1.59(GND) U5.8(GND) U6.8(GND)
PP_HV1: C26.2 C27.2 C28.2 C29.2 C30.2 U1.11(PP_HV1) U1.12(PP_HV1) U5.5(VIN) U5.12(VIN)
DRAIN1: U1.7(DRAIN2) U1.8(DRAIN1) U1.15(DRAIN1) U1.19(DRAIN1) U1.52(DRAIN2) U1.56(DRAIN2) U1.57(DRAIN2) U1.58(DRAIN1)
LDO_1V8: C32.2 U1.35(LDO_1V8) ; port LDO_1V8
LDO_3V3: C31.2 U1.9(LDO_3V3) ; port LDO_3V3
PP_HV1_EN: U5.1(EN/UVLO) ; port PP_HV1_EN
VBUS_CONN: C19.2 R14.2 U1.3(VBUS2) U1.4(VBUS2) U1.13(VBUS1) U1.14(VBUS1) ; port VBUS_CONN
NetC20_2: C20.2 R14.1
NetC25_1: C25.1 U1.1(PP_HV2) U1.2(PP_HV2) U5.6(VOUT) U5.11(VOUT) U6.6(VOUT) U6.11(VOUT)
NetU5_3: U5.3(SPLYGD) U6.2(OVLO)

Not connected (* = marked no-connect by the designer): U5 2(OVLO) 4(~{FLT}) 7(DVDT) 9(ILM) 10(ITIMER); U6 1(EN/UVLO) 3(SPLYGD) 4(~{FLT}) 7(DVDT) 9(ILM) 10(ITIMER)

### Channels
Downstream_Port/Port_Power: designators C19=C19_1 C20=C20_1 C25=C25_1 C26=C26_1 C27=C27_1 C28=C28_1 C29=C29_1 C30=C30_1 C31=C31_1 C32=C32_1 C33=C33_1 C34=C34_1 R14=R14_1 U1=U1_1#2 U5=U5_1 U6=U6_1; ports LDO_1V8=NetC32_1_2 LDO_3V3=NetC16_1_2 PP_HV1_EN=NetU5_1_1 VBUS_CONN=NetC19_1_2
Upstream_Port/Port_Power: designators C19=C19_2 C20=C20_2 C25=C25_2 C26=C26_2 C27=C27_2 C28=C28_2 C29=C29_2 C30=C30_2 C31=C31_2 C32=C32_2 C33=C33_2 C34=C34_2 R14=R14_2 U1=U1_2#2 U5=U5_2 U6=U6_2; ports LDO_1V8=NetC32_2_2 LDO_3V3=NetC16_2_2 PP_HV1_EN=NetU5_2_1 VBUS_CONN=NetC19_2_2
Downstream_Port/Port_Power: designators C19=C19_3 C20=C20_3 C25=C25_3 C26=C26_3 C27=C27_3 C28=C28_3 C29=C29_3 C30=C30_3 C31=C31_3 C32=C32_3 C33=C33_3 C34=C34_3 R14=R14_3 U1=U1_3#2 U5=U5_3 U6=U6_3; ports LDO_1V8=NetC32_3_2 LDO_3V3=NetC16_3_2 PP_HV1_EN=NetU5_3_1 VBUS_CONN=NetC19_3_2

### Notes on the sheet
- DWG. NO.
- REV.
- SHT.
- THIS DOCUMENT AND THE DATA DISCLOSED HEREIN OR HEREWITH IS THE PROPERTY OF ALTIUM LIMITED AND MAY BE FREELY DISTRIBUTED IN WHOLE. NO RIGHTS ARE RESERVED OR EXPRESS OR IMPLIED WARANTEE GIVEN.
- REVISION
- DESCRIPTION
- DATE
- APPROVED
- ENG:
- APPROVALS
- PROJECT
- DSN:
- CHK:
- REFERENCE DOCUMENTS
- PROJECT REVISION:
- TITLE
- DOCUMENT REVISION:
- DESIGN ITEM:
- BOM:
- FAB DWG:
- PCB DWG:
- ASSY DWG:
- SCALE:
- SIZE
- B
- CAGE CODE
- FILE NAME
- DWG NO.
- SHEET
- OF
- REV

### Library data of the parts
C19 = GRM155R61H105KE05D: as C11 on sheet Port_Controller; Temperature Coefficient: X5R; Package: 0402 (1005 Metric); Voltage: 50V
C20 C25 C32 C34 = GRT21BR61H475KE13L: 4.7 µF ±10% 50V Ceramic Capacitor X5R 0805 (2012 Metric); Temperature Coefficient: X5R; Package: 0402 (1005 Metric); Voltage: 50V
C26-C30 = CL31A106KBHNNNE: 10 µF ±10% 50V Ceramic Capacitor X5R 1206 (3216 Metric); Temperature Coefficient: X5R; Package: 0402 (1005 Metric)
C31 C33 = CL05A106MQ5NUNC: as C12 on sheet Port_Controller; Package: 0402 (1005 Metric); Voltage: 6.3V
R14 = ESR10EZPJ3R3: 3.3 Ohms ±5% 0.5W, 1/2W Chip Resistor 0805 (2012 Metric) Automotive AEC-Q200, Pulse Withstanding Thick Film; Manufacturer 1: Rohm Semiconductor; Manufacturer Part Number 1: ESR10EZPJ3R3; Supplier Part Number 1: RHM3.3KCT-ND; Supplier 1: Digi-Key; Power Rating: 1/2W
U1 = TPS65987DDHRSHR: as U1 on sheet Port_Controller; Manufacturer Product Number: TPS65987DDHRSHR; Supplier: DigiKey; Supplier Part Number: 296-52067-1-ND; Datasheet: https://www.ti.com/lit/ds/symlink/tps65987d.pdf?HQS=dis-dk-null-digikeymode-dsf-pf-null-wwe&ts=1769374030059; Operating Temperature: -10°C ~ 75°C
U5 U6 = TPS259480AYWPR: Electronic Fuse Regulator High-Side 8A 12-DSBGA (2.43x1.74); Manufacturer: Texas Instruments; Manufacturer Product Number: TPS259480AYWPR; Supplier: DigiKey; Supplier Part Number: 296-TPS259480AYWPRCT-ND; Datasheet: https://www.ti.com/lit/ds/symlink/tps25948.pdf?ts=1769684043287; Operating Temperature: -40°C ~ 125°C

## Sheet Upstream_Port.SchDoc: Upstream Port
size 431 x 279 mm; Author: Eric Liu; SheetNumber: 5; SheetTotal: 6
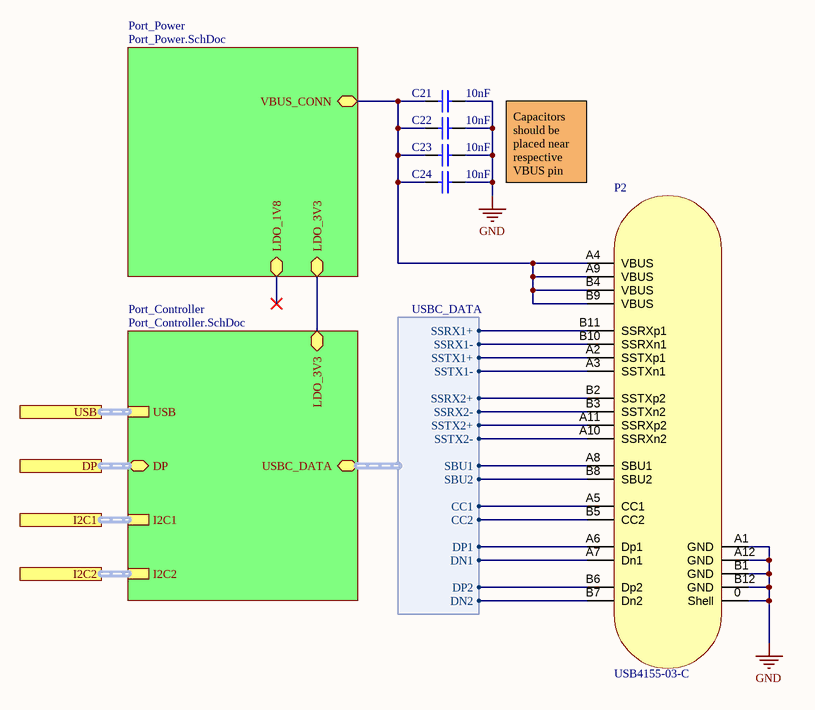
[diagram p4: Upstream_Port.SchDoc]

### Parts
C21  value 10nF  [CAP0402]  (hidden comment: CC0402KRX7R9BB103)
C22  value 10nF  [CAP0402]  (hidden comment: CC0402KRX7R9BB103)
C23  value 10nF  [CAP0402]  (hidden comment: CC0402KRX7R9BB103)
C24  value 10nF  [CAP0402]  (hidden comment: CC0402KRX7R9BB103)
P2  USB4155-03-C  [USB4155-03-C]

### Sub-sheets
Port_Controller = Port_Controller.SchDoc: USB (harness USB), I2C1 (harness USB), DP (bidir, harness DP), USBC_DATA (bidir, harness USBC_DATA), LDO_3V3 (bidir), I2C2 (harness USB)
Port_Power = Port_Power.SchDoc: LDO_3V3 (bidir), LDO_1V8 (bidir), VBUS_CONN (bidir)

### Ports
DP, I2C1, I2C2, USB

### Harnesses
USBC_DATA: SSRX1+, SSRX1-, SSTX1+, SSTX1-, SSRX2+, SSRX2-, SSTX2+, SSTX2-, CC1, CC2, SBU1, SBU2, DP1, DN1, DP2, DN2

### Nets
GND: C21.1 C22.1 C23.1 C24.1 P2.0(Shell) P2.A1(GND) P2.A12(GND) P2.B1(GND) P2.B12(GND)
DN: P2.A7(Dn1) P2.B7(Dn2) ; sheet Port_Controller/USBC_DATA.DN1, sheet Port_Controller/USBC_DATA.DN2
DP: P2.A6(Dp1) P2.B6(Dp2) ; sheet Port_Controller/USBC_DATA.DP1, sheet Port_Controller/USBC_DATA.DP2
NetC1_2_2: P2.A2(SSTXp1) ; sheet Port_Controller/USBC_DATA.SSTX1+
NetC2_2_2: P2.A3(SSTXn1) ; sheet Port_Controller/USBC_DATA.SSTX1-
NetC3_2_2: P2.B2(SSTXp2) ; sheet Port_Controller/USBC_DATA.SSRX2+
NetC4_2_2: P2.B3(SSTXn2) ; sheet Port_Controller/USBC_DATA.SSRX2-
NetC16_2_2: sheet Port_Controller/LDO_3V3, sheet Port_Power/LDO_3V3
NetC19_2_2: C21.2 C22.2 C23.2 C24.2 P2.A4(VBUS) P2.A9(VBUS) P2.B4(VBUS) P2.B9(VBUS) ; sheet Port_Power/VBUS_CONN
NetP2_A5: P2.A5(CC1) ; sheet Port_Controller/USBC_DATA.CC1
NetP2_A8: P2.A8(SBU1) ; sheet Port_Controller/USBC_DATA.SBU1
NetP2_A10: P2.A10(SSRXn2) ; sheet Port_Controller/USBC_DATA.SSTX2-
NetP2_A11: P2.A11(SSRXp2) ; sheet Port_Controller/USBC_DATA.SSTX2+
NetP2_B5: P2.B5(CC2) ; sheet Port_Controller/USBC_DATA.CC2
NetP2_B8: P2.B8(SBU2) ; sheet Port_Controller/USBC_DATA.SBU2
NetP2_B10: P2.B10(SSRXn1) ; sheet Port_Controller/USBC_DATA.SSRX1-
NetP2_B11: P2.B11(SSRXp1) ; sheet Port_Controller/USBC_DATA.SSRX1+

### Buses and harness runs
harness port DP = sheet Port_Controller/DP
harness port I2C1 = sheet Port_Controller/I2C1
harness port I2C2 = sheet Port_Controller/I2C2
harness port USB = sheet Port_Controller/USB

### Notes on the sheet
- Capacitors should be placed near respective VBUS pin
- DWG. NO.
- REV.
- SHT.
- THIS DOCUMENT AND THE DATA DISCLOSED HEREIN OR HEREWITH IS THE PROPERTY OF ALTIUM LIMITED AND MAY BE FREELY DISTRIBUTED IN WHOLE. NO RIGHTS ARE RESERVED OR EXPRESS OR IMPLIED WARANTEE GIVEN.
- REVISION
- DESCRIPTION
- DATE
- APPROVED
- ENG:
- APPROVALS
- PROJECT
- DSN:
- CHK:
- REFERENCE DOCUMENTS
- PROJECT REVISION:
- TITLE
- DOCUMENT REVISION:
- DESIGN ITEM:
- BOM:
- FAB DWG:
- PCB DWG:
- ASSY DWG:
- SCALE:
- SIZE
- B
- CAGE CODE
- FILE NAME
- DWG NO.
- SHEET
- OF
- REV

### Library data of the parts
C21-C24 = CC0402KRX7R9BB103: as C35 on sheet Downstream_Port; Temperature Coefficient: X7R; Package: 0402 (1005 Metric); Voltage: 50V
P2 = USB4155-03-C: USB-C (USB TYPE-C) USB 3.2 Gen 2 (USB 3.1 Gen 2, Superspeed + (USB 3.1)) Plug Connector 24 Position Board Edge, Surface Mount; Through Hole, Right Angle; Manufacturer: GCT; Manufacturer Product Number: USB4056-03-A; Voltage: 48VDC; Supplier: DigiKey; Supplier Part Number: 2073-USB4056-03-ACT-ND; Datasheet: https://gct.co/connector/usb4056; Standards: USB 3.2 Gen 2; Operating Temperature: -25°C ~ 85°C

## Sheet IC_Power.SchDoc: IC Power
size 431 x 279 mm; Author: Eric Liu; SheetNumber: 6; SheetTotal: 6

### Notes on the sheet
- DWG. NO.
- REV.
- SHT.
- THIS DOCUMENT AND THE DATA DISCLOSED HEREIN OR HEREWITH IS THE PROPERTY OF ALTIUM LIMITED AND MAY BE FREELY DISTRIBUTED IN WHOLE. NO RIGHTS ARE RESERVED OR EXPRESS OR IMPLIED WARANTEE GIVEN.
- REVISION
- DESCRIPTION
- DATE
- APPROVED
- ENG:
- APPROVALS
- PROJECT
- DSN:
- CHK:
- REFERENCE DOCUMENTS
- PROJECT REVISION:
- TITLE
- DOCUMENT REVISION:
- DESIGN ITEM:
- BOM:
- FAB DWG:
- PCB DWG:
- ASSY DWG:
- SCALE:
- SIZE
- B
- CAGE CODE
- FILE NAME
- DWG NO.
- SHEET
- OF
- REV

## Nets that join several sheets
+3.3V: Downstream_Port/Port_Controller (16 pins), Downstream_Port/Port_Power (C33_1.2 U1_1#2.5), Upstream_Port/Port_Controller (16 pins), Upstream_Port/Port_Power (C33_2.2 U1_2#2.5), Downstream_Port/Port_Controller (16 pins), Downstream_Port/Port_Power (C33_3.2 U1_3#2.5)
+5V: Downstream_Port/Port_Power (C34_1.2 U1_1#2.25 U6_1.5 U6_1.12), Upstream_Port/Port_Power (C34_2.2 U1_2#2.25 U6_2.5 U6_2.12), Downstream_Port/Port_Power (C34_3.2 U1_3#2.25 U6_3.5 U6_3.12)
GND: Downstream_Port (9 pins), Downstream_Port/Port_Controller (32 pins), Downstream_Port/Port_Power (20 pins), Upstream_Port (9 pins), Upstream_Port/Port_Controller (32 pins), Upstream_Port/Port_Power (20 pins), Downstream_Port (9 pins), Downstream_Port/Port_Controller (32 pins), Downstream_Port/Port_Power (20 pins)
PP_HV1: Downstream_Port/Port_Power (9 pins), Upstream_Port/Port_Power (9 pins), Downstream_Port/Port_Power (9 pins)
DN: Downstream_Port (P1_1.A7 P1_1.B7), Downstream_Port/Port_Controller (U1_1#1.53 U3_1.19)
DN: Upstream_Port (P2.A7 P2.B7), Upstream_Port/Port_Controller (U1_2#1.53 U3_2.19)
DN: Downstream_Port (P1_2.A7 P1_2.B7), Downstream_Port/Port_Controller (U1_3#1.53 U3_3.19)
DP: Downstream_Port (P1_1.A6 P1_1.B6), Downstream_Port/Port_Controller (U1_1#1.50 U3_1.20)
DP: Upstream_Port (P2.A6 P2.B6), Upstream_Port/Port_Controller (U1_2#1.50 U3_2.20)
DP: Downstream_Port (P1_2.A6 P1_2.B6), Downstream_Port/Port_Controller (U1_3#1.50 U3_3.20)
NetC1_1_2: Downstream_Port (P1_1.A2), Downstream_Port/Port_Controller (C1_1.2)
NetC1_2_2: Upstream_Port (P2.A2), Upstream_Port/Port_Controller (C1_2.2)
NetC1_3_2: Downstream_Port (P1_2.A2), Downstream_Port/Port_Controller (C1_3.2)
NetC2_1_2: Downstream_Port (P1_1.A3), Downstream_Port/Port_Controller (C2_1.2)
NetC2_2_2: Upstream_Port (P2.A3), Upstream_Port/Port_Controller (C2_2.2)
NetC2_3_2: Downstream_Port (P1_2.A3), Downstream_Port/Port_Controller (C2_3.2)
NetC3_1_2: Downstream_Port (P1_1.B2), Downstream_Port/Port_Controller (C3_1.2)
NetC3_2_2: Upstream_Port (P2.B2), Upstream_Port/Port_Controller (C3_2.2)
NetC3_3_2: Downstream_Port (P1_2.B2), Downstream_Port/Port_Controller (C3_3.2)
NetC4_1_2: Downstream_Port (P1_1.B3), Downstream_Port/Port_Controller (C4_1.2)
NetC4_2_2: Upstream_Port (P2.B3), Upstream_Port/Port_Controller (C4_2.2)
NetC4_3_2: Downstream_Port (P1_2.B3), Downstream_Port/Port_Controller (C4_3.2)
NetC16_1_2: Downstream_Port/Port_Controller (9 pins), Downstream_Port/Port_Power (C31_1.2 U1_1#2.9)
NetC16_2_2: Upstream_Port/Port_Controller (9 pins), Upstream_Port/Port_Power (C31_2.2 U1_2#2.9)
NetC16_3_2: Downstream_Port/Port_Controller (9 pins), Downstream_Port/Port_Power (C31_3.2 U1_3#2.9)
NetC19_1_2: Downstream_Port (8 pins), Downstream_Port/Port_Power (6 pins)
NetC19_2_2: Upstream_Port (8 pins), Upstream_Port/Port_Power (6 pins)
NetC19_3_2: Downstream_Port (8 pins), Downstream_Port/Port_Power (6 pins)
NetP1_1_A5: Downstream_Port (P1_1.A5), Downstream_Port/Port_Controller (U3_1.4 U3_1.7)
NetP1_1_A8: Downstream_Port (P1_1.A8), Downstream_Port/Port_Controller (U3_1.1)
NetP1_1_A10: Downstream_Port (P1_1.A10), Downstream_Port/Port_Controller (U2_1.33)
NetP1_1_A11: Downstream_Port (P1_1.A11), Downstream_Port/Port_Controller (U2_1.34)
NetP1_1_B5: Downstream_Port (P1_1.B5), Downstream_Port/Port_Controller (U3_1.5 U3_1.6)
NetP1_1_B8: Downstream_Port (P1_1.B8), Downstream_Port/Port_Controller (U3_1.2)
NetP1_1_B10: Downstream_Port (P1_1.B10), Downstream_Port/Port_Controller (U2_1.24)
NetP1_1_B11: Downstream_Port (P1_1.B11), Downstream_Port/Port_Controller (U2_1.25)
NetP1_2_A5: Downstream_Port (P1_2.A5), Downstream_Port/Port_Controller (U3_3.4 U3_3.7)
NetP1_2_A8: Downstream_Port (P1_2.A8), Downstream_Port/Port_Controller (U3_3.1)
NetP1_2_A10: Downstream_Port (P1_2.A10), Downstream_Port/Port_Controller (U2_3.33)
NetP1_2_A11: Downstream_Port (P1_2.A11), Downstream_Port/Port_Controller (U2_3.34)
NetP1_2_B5: Downstream_Port (P1_2.B5), Downstream_Port/Port_Controller (U3_3.5 U3_3.6)
NetP1_2_B8: Downstream_Port (P1_2.B8), Downstream_Port/Port_Controller (U3_3.2)
NetP1_2_B10: Downstream_Port (P1_2.B10), Downstream_Port/Port_Controller (U2_3.24)
NetP1_2_B11: Downstream_Port (P1_2.B11), Downstream_Port/Port_Controller (U2_3.25)
NetP2_A5: Upstream_Port (P2.A5), Upstream_Port/Port_Controller (U3_2.4 U3_2.7)
NetP2_A8: Upstream_Port (P2.A8), Upstream_Port/Port_Controller (U3_2.1)
NetP2_A10: Upstream_Port (P2.A10), Upstream_Port/Port_Controller (U2_2.33)
NetP2_A11: Upstream_Port (P2.A11), Upstream_Port/Port_Controller (U2_2.34)
NetP2_B5: Upstream_Port (P2.B5), Upstream_Port/Port_Controller (U3_2.5 U3_2.6)
NetP2_B8: Upstream_Port (P2.B8), Upstream_Port/Port_Controller (U3_2.2)
NetP2_B10: Upstream_Port (P2.B10), Upstream_Port/Port_Controller (U2_2.24)
NetP2_B11: Upstream_Port (P2.B11), Upstream_Port/Port_Controller (U2_2.25)

## Assembly variants
Default: not fitted R9_3
Flash Disabled: not fitted R7_3